# Altium schematic sheet PowerSupply.SchDoc
size A4
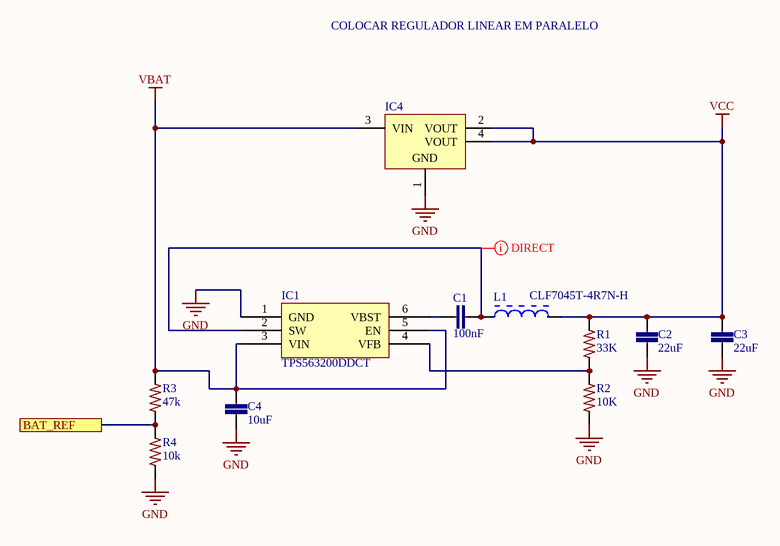
[diagram p0: PowerSupply.SchDoc]

## Parts
C1  100nF  [0402-CAP]
C2  22uF  [1206-CAP]
C3  22uF  [1206-CAP]
C4  10uF  [1210-CAP]
IC1  TPS563200DDCT  [SOT95P280X110-6N]
IC4  LD1117S33CTR  [SOT-223_N]  (value not drawn)
L1  CLF7045T-4R7N-H  [CLF7045T]
R1  33K  [0402-RES-HD]
R2  10K  [0402-RES-HD]
R3  47k  [0402-RES-HD]
R4  10k  [0402-RES-HD]

## Ports
BAT_REF

## Nets
GND: C2.1 C3.1 C4.1 IC1.1(GND) IC4.1(GND) R2.1 R4.1
VBAT: C4.2 IC1.3(VIN) IC1.5(EN) IC4.3(VIN) R3.2
VCC: C2.2 C3.2 IC4.2(VOUT) IC4.4(VOUT) L1.2 R1.2
BAT_REF: R3.1 R4.2 ; port BAT_REF
NetC1_1: C1.1 IC1.6(VBST)
NetC1_2: C1.2 IC1.2(SW) L1.1
NetIC1_4: IC1.4(VFB) R1.1 R2.2

## Layout directives
net class DIRECT: NetC1_2

## Notes on the sheet
- COLOCAR REGULADOR LINEAR EM PARALELO

## Library data of the parts
C1 = CC0402-100nF-50v-A.3: CAP CER 0.1UF 50V 10% X7R 0402; Part No: C1005X7R1H104K050BB; Value: 100n; Cod EMS: 05.281.019.021
C2 C3 = CC1206-22uF-6.3V-1: CAP CER 22UF 6.3V 20% X5R 1206; Part No: C3216X5R0J226M085AC; Value: 22u; Rule: UNIONINDEX{}0[]RULEKIND{}PolygonConnect[]NETSCOPE{}AnyNet[]LAYERKIND{}SameLayer[]NAME{}Schematic Polygon Connect Style[]CONNECTSTYLE{}Direct[]RELIEFCONDUCTORWIDTH{}10mil[]RELIEFENTRIES{}4[]POLYGONRELIEFANGLE{}45 Angle[]AIRGAPWIDTH{}10mil[]UNIT{}Imperial[]PcbType{}ProtelPcb
C4 = CC1210-10uF-6: CAP CER 10UF 50V 20% X5R 1210; Part No: UMK325BJ106MM; value: 10u; Cod EMS: 05.281.019.522
IC1 = TPS563200DDCT-01.A.2: IC REG BUCK ADJ 3A SYNC 6SOT
IC4 = CMP-0244-00307-1: Fixed Low Drop Positive Voltage Regulator, 3.3V, 4-Pin SOT-223, Tape and Reel; ComponentLink1URL: http://www.st.com; PackageVersion: 2010; ComponentLink1Description: Manufacturer URL; DatasheetVersion: 1/11/2011; ComponentLink2URL: http://www.st.com/internet/com/TECHNICAL_RESOURCES/TECHNICAL_LITERATURE/DATASHEET/CD00000544.pdf; PackageReference: SOT-223; ComponentLink2Description: Datasheet; PackageDescription: 4-Pin SOT-223 Package, 6.5 x 3.5 mm Body, 2.3 mm Pitch, 7 mm Lead Span
L1 = CLF7045T-4R7N-H-2: FIXED IND 4.7UH 4.1A 20 MOHM SMD; Family Description: INDUTORES FIXOS 7,2x6,9mm TDK CLF7045T -45 A 125oC; Rule: UNIONINDEX{}0[]RULEKIND{}PolygonConnect[]NETSCOPE{}AnyNet[]LAYERKIND{}SameLayer[]NAME{}Schematic Polygon Connect Style[]CONNECTSTYLE{}Direct[]RELIEFCONDUCTORWIDTH{}10mil[]RELIEFENTRIES{}4[]POLYGONRELIEFANGLE{}45 Angle[]AIRGAPWIDTH{}10mil[]UNIT{}Imperial[]PcbType{}ProtelPcb; Part No: CLF7045T-4R7N-H; Family: CLF7045T
R1 = R0402-33K-7: RES 33K OHM 1/10W 1% 0402 SMD; Part No: ERJ-2RKF3302X; Family Description: RESISTOR FILME ESPESSO 10R-1M / 1/10W / 1% / 0402. P/N: ERJ-2RKF....X – PANASONIC ELECTRONIC COMPONENTS.; Cod EMS: 05.280.029.535; Value: 33K; Family: ERJ-2RKF....X
R2 = R0402-10K-10: RES 10K OHM 1/10W 1% 0402 SMD; Part No: ERJ-2RKF1002X; Cod EMS: 05.280.029.525; Family Description: RESISTOR FILME ESPESSO 10R-1M / 1/10W / 1% / 0402. P/N: ERJ-2RKF....X – PANASONIC ELECTRONIC COMPONENTS.; Value: 10K; Family: ERJ-2RKF....X
R3 = R0402-10K-10: RES 47k OHM 1/10W 1% 0402 SMD; Part No: ERJ-2RKF1002X; Cod EMS: 05.280.029.525; Value: 330; Family Description: RESISTOR FILME ESPESSO 10R-1M / 1/10W / 1% / 0402. P/N: ERJ-2RKF....X – PANASONIC ELECTRONIC COMPONENTS.; Family: ERJ-2RKF....X
R4 = R0402-33K-7: RES 10k OHM 1/10W 1% 0402 SMD; Part No: ERJ-2RKF3302X; Cod EMS: 05.280.029.535; Value: 100; Family Description: RESISTOR FILME ESPESSO 10R-1M / 1/10W / 1% / 0402. P/N: ERJ-2RKF....X – PANASONIC ELECTRONIC COMPONENTS.; Family: ERJ-2RKF....X